# Altium schematic sheet mcu.SchDoc
size A3
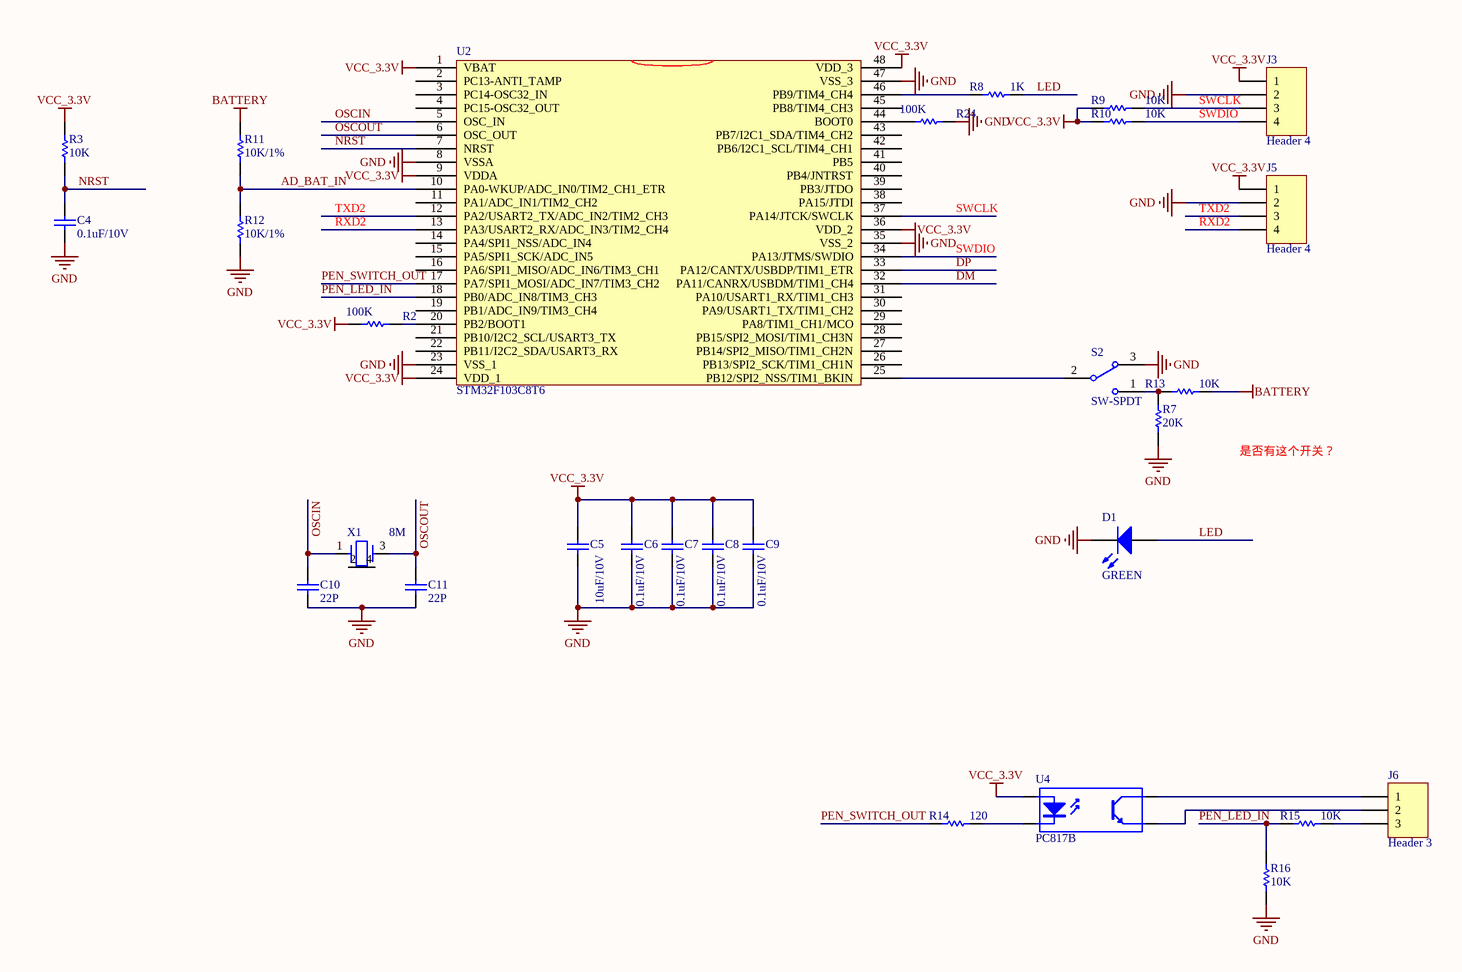
[diagram p0: mcu.SchDoc]

## Parts
C4  0.1uF/10V  [0402C]
C5  10uF/10V  [0603C]
C6  0.1uF/10V  [0402C]
C7  0.1uF/10V  [0402C]
C8  0.1uF/10V  [0402C]
C9  0.1uF/10V  [0402C]
C10  22P  [0402C]
C11  22P  [0402C]
D1  Publisher: GREEN  [0603LED]
J3  Header 4  [HDR1X4]
J5  Header 4  [HDR1X4]
J6  Header 3  [HDR1X3]
R2  100K  [0402R]
R3  10K  [0402R]
R7  20K  [0402R]
R8  1K  [0402R]
R9  10K  [0402R]
R10  10K  [0402R]
R11  10K/1%  [0402R]
R12  10K/1%  [0402R]
R13  10K  [0402R]
R14  120  [0402R]
R15  10K  [0402R]
R16  10K  [0402R]
R24  100K  [0402R]
S2  SW-SPDT
U2  STM32F103C8T6  [TQFP-48]
U4  PC817B  [DIP-4]
X1  8M  [XTAL4TN_3225]

## Nets
BATTERY: R11.1 R13.1
GND: C4.1 C5.1 C6.1 C7.1 C8.1 C9.1 C10.1 C11.1 D1.2(K) J3.2 J5.2 R7.2 R12.2 R16.1 R24.1 S2.3 U2.8(VSSA) U2.23(VSS_1) U2.35(VSS_2) U2.47(VSS_3)
VCC_3.3V: C5.2 C6.2 C7.2 C8.2 C9.2 J3.1 J5.1 R2.2 R3.1 R9.1 R10.1 U2.1(VBAT) U2.9(VDDA) U2.24(VDD_1) U2.36(VDD_2) U2.48(VDD_3) U4.1(A)
AD_BAT_IN: R11.2 R12.1 U2.10(PA0-WKUP/ADC_IN0/TIM2_CH1_ETR)
DM: U2.32(PA11/CANRX/USBDM/TIM1_CH4)
DP: U2.33(PA12/CANTX/USBDP/TIM1_ETR)
LED: D1.1(A) R8.2
NRST: C4.2 R3.2 U2.7(NRST)
OSCIN: C10.2 U2.5(OSC_IN) X1.1(X1)
OSCOUT: C11.2 U2.6(OSC_OUT) X1.3(X2)
PEN_LED_IN: R15.1 R16.2 U2.18(PB0/ADC_IN8/TIM3_CH3)
PEN_SWITCH_OUT: R14.1 U2.17(PA7/SPI1_MOSI/ADC_IN7/TIM3_CH2)
RXD2: J5.4 U2.13(PA3/USART2_RX/ADC_IN3/TIM2_CH4)
SWCLK: J3.3 R9.2 U2.37(PA14/JTCK/SWCLK)
SWDIO: J3.4 R10.2 U2.34(PA13/JTMS/SWDIO)
TXD2: J5.3 U2.12(PA2/USART2_TX/ADC_IN2/TIM2_CH3)
NetJ6_1: J6.1 U4.4(C)
NetJ6_2: J6.2 U4.3(E)
NetJ6_3: J6.3 R15.2
NetR2_1: R2.1 U2.20(PB2/BOOT1)
NetR7_1: R7.1 R13.2 S2.1
NetR8_1: R8.1 U2.46(PB9/TIM4_CH4)
NetR14_2: R14.2 U4.2(K)
NetR24_2: R24.2 U2.44(BOOT0)
NetS2_2: S2.2 U2.25(PB12/SPI2_NSS/TIM1_BKIN)

Not connected (* = marked no-connect by the designer): U2 2(PC13-ANTI_TAMP) 3(PC14-OSC32_IN) 4(PC15-OSC32_OUT) 11(PA1/ADC_IN1/TIM2_CH2) 14(PA4/SPI1_NSS/ADC_IN4) 15(PA5/SPI1_SCK/ADC_IN5) 16(PA6/SPI1_MISO/ADC_IN6/TIM3_CH1) 19(PB1/ADC_IN9/TIM3_CH4) 21(PB10/I2C2_SCL/USART3_TX) 22(PB11/I2C2_SDA/USART3_RX) 26(PB13/SPI2_SCK/TIM1_CH1N) 27(PB14/SPI2_MISO/TIM1_CH2N) 28(PB15/SPI2_MOSI/TIM1_CH3N) 29(PA8/TIM1_CH1/MCO) 30(PA9/USART1_TX/TIM1_CH2) 31(PA10/USART1_RX/TIM1_CH3) 38(PA15/JTDI) 39(PB3/JTDO) 40(PB4/JNTRST) 41(PB5) 42(PB6/I2C1_SCL/TIM4_CH1) 43(PB7/I2C1_SDA/TIM4_CH2) 45(PB8/TIM4_CH3); X1 2(GND) 4(GND)

## Notes on the sheet
- 是否有这个开关？

## Library data of the parts
C4-C11 = Cap: Capacitor; Value: 100pF; Published: 8-Jun-2000; LatestRevisionDate: 17-Jul-2002; LatestRevisionNote: Re-released for DXP Platform.; PackageReference: RAD-0.3; Publisher: Altium Limited
D1 = LED0: Typical INFRARED GaAs LED; Published: 8-Jun-2000; LatestRevisionDate: 08-Jul-2005; LatestRevisionNote: Mech Layer 1 removed.; PackageReference: LED-0
J3 J5 = Header 4: Header, 4-Pin; LatestRevisionDate: 17-Jul-2002; LatestRevisionNote: Re-released for DXP Platform.; Publisher: Altium Limited
J6 = Header 3: Header, 3-Pin; LatestRevisionDate: 17-Jul-2002; LatestRevisionNote: Re-released for DXP Platform.; Publisher: Altium Limited
R2 R24 = Res1: Resistor; Published: 8-Jun-2000; LatestRevisionDate: 17-Jul-2002; LatestRevisionNote: Re-released for DXP Platform.; PackageReference: AXIAL-0.3; Publisher: Altium Limited; Value: 100K
R3 R7 R9-R16 = Res Semi: Semiconductor Resistor; Value: 1K; Published: 8-Jun-2000; LatestRevisionDate: 17-Jul-2002; LatestRevisionNote: Re-released for DXP Platform.; PackageReference: AXIAL-0.5; Publisher: Altium Limited
R8 = Res Semi: Semiconductor Resistor; Published: 8-Jun-2000; LatestRevisionDate: 17-Jul-2002; LatestRevisionNote: Re-released for DXP Platform.; PackageReference: AXIAL-0.5; Publisher: Altium Limited; Value: 1K
S2 = SW-SPDT: SPDT Subminiature Toggle Switch, Right Angle Mounting, Vertical Actuation; Published: 24-Mar-1999; LatestRevisionDate: 17-Dec-2003; LatestRevisionNote: Schematic revised, PCB Footprint replaced.; DatasheetVersion: 05-Dec-2000; PackageReference: TL36WW15050; Publisher: Altium Limited; ComponentLink1Description: Manufacturer Link; ComponentLink1URL: http://www.apem.com
U2 = STM32F103C6
U4 = Optoisolator1: 4-Pin Phototransistor Optocoupler; Published: 24-Mar-1999; LatestRevisionDate: 04-Mar-2005; LatestRevisionNote: Sch pins 3 & 4 Swapped.; DatasheetVersion: Nov-2003; PackageReference: DIP-4; Publisher: Altium Limited
X1 = CRYSTAL-4